# EAGLE schematic plugV15-smd (EAGLE 7.5.0)
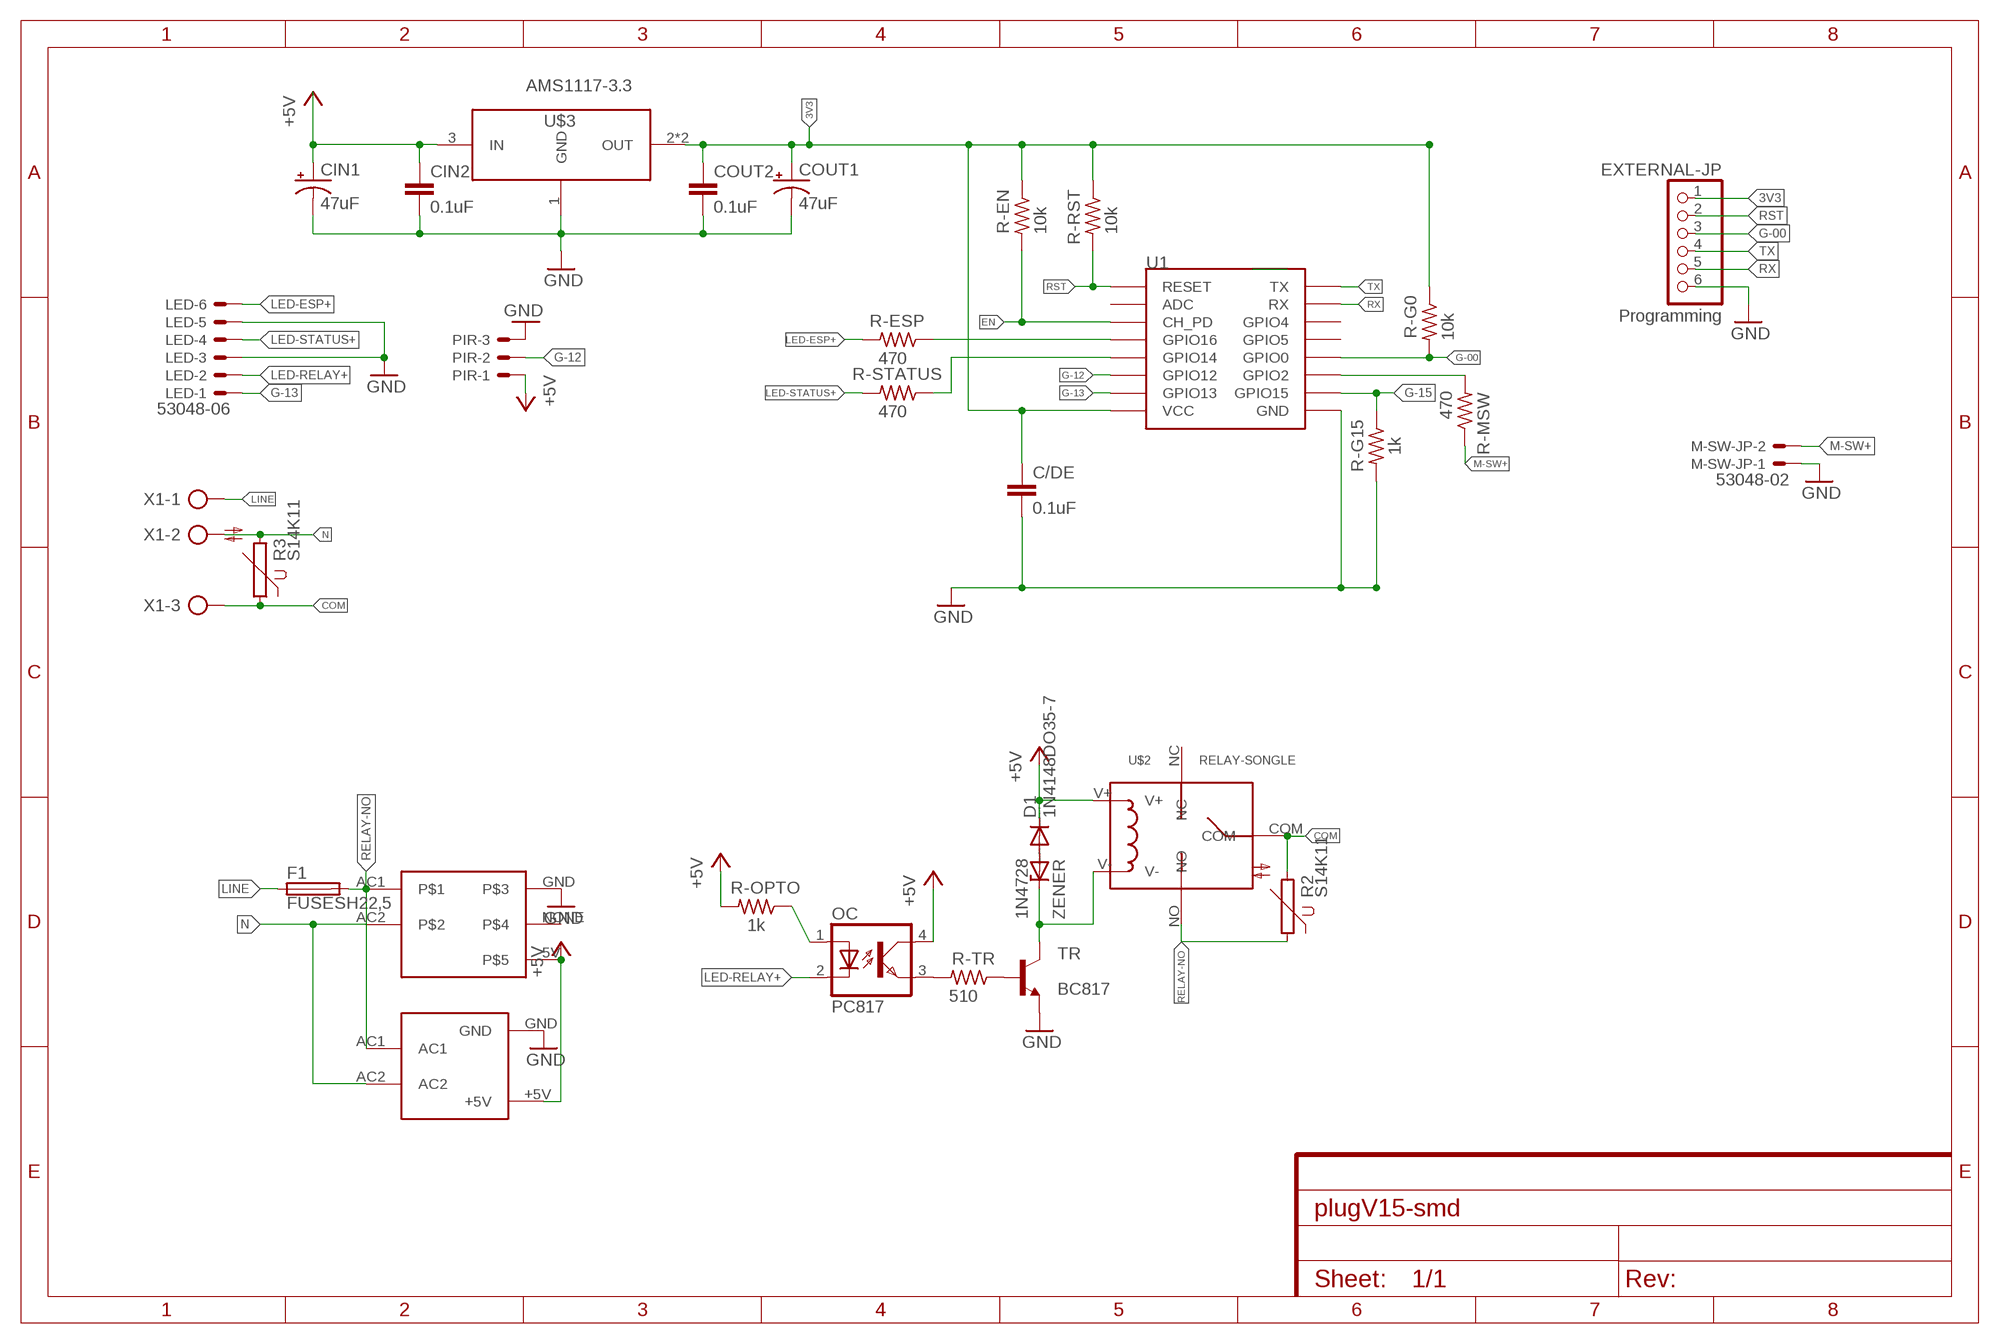
[diagram p0: schematic, sheet 1]

## Parts
C/DE  0.1uF  C-EUC0805  [C0805]
CIN1  47uF  CPOL-USE2.5-5  [E2,5-5]
CIN2  0.1uF  C-EUC0805  [C0805]
COUT1  47uF  CPOL-USE2.5-5  [E2,5-5]
COUT2  0.1uF  C-EUC0805  [C0805]
D1  1N4148DO35-7  [DO35-7]
EXTERNAL-JP  Programming  PINHD-1X6  [1X06]
F1  FUSESH22,5  [SH22,5]
LED  53048-06  [53048-06]
M-SW-JP  53048-02  [53048-02]
OC  PC817  [DIL04]
PIR  53048-03  [53048-03]
R2  S14K11  [S14K11]
R3  S14K11  [S14K11]
R-EN  10k  R-US_M0805  [M0805]
R-ESP  470  R-US_M0805  [M0805]
R-G0  10k  R-US_M0805  [M0805]
R-G15  1k  R-US_M0805  [M0805]
R-MSW  470  R-US_M0805  [M0805]
R-OPTO  1k  R-US_M0805  [M0805]
R-RST  10k  R-US_M0805  [M0805]
R-STATUS  470  R-US_M0805  [M0805]
R-TR  510  R-US_M0805  [M0805]
TR  BC817  BC817-16SMD  [SOT23-BEC]
U1  ESP12SMD  [ESP12-SMD]
U$1  HLK-PM01  [HLK-PM01]
U$2  RELAY-SONGLE  [RELAY-SONGLE]
U$3  AMS1117-3.3  [SOT-223]
U$4  POWERSUPPLY-5V-700MA  [POWERSUPPLY-5V-700MA]
X1  AK300/3  [AK300/3]
ZENER  1N4728  [DO41Z10]

## Nets
3V3: C/DE.1 COUT1.+ COUT2.1 EXTERNAL-JP.1 R-EN.1 R-G0.1 R-RST.1 U1.VCC U$3.2(OUT) U$3.4(OUT)
+5V: CIN1.+ CIN2.1 D1.C OC.4(COL) PIR.1 R-OPTO.2 U$1.+5V U$2.V+ U$3.3(IN) U$4.5V
COM: R2.2 R3.1 U$2.COM X1.3
EN: R-EN.2 U1.CH_PD
G-00: EXTERNAL-JP.3 R-G0.2 U1.GPIO0
G-12: PIR.2 U1.GPIO12
G-13: LED.1 U1.GPIO13
G-15: R-G15.1 U1.GPIO15
GND: C/DE.2 CIN1.- CIN2.2 COUT1.- COUT2.2 EXTERNAL-JP.6 LED.3 LED.5 M-SW-JP.1 PIR.3 R-G15.2 TR.E U1.GND U$1.GND U$3.1(GND) U$4.GND
LED-ESP+: LED.6 R-ESP.2
LED-RELAY+: LED.2 OC.2(C)
LED-STATUS+: LED.4 R-STATUS.2
LINE: F1.1 X1.1
M-SW+: M-SW-JP.2 R-MSW.1
N: R3.2 U$1.AC2 U$4.AC2 X1.2
N$1: OC.3(EMIT) R-TR.2
N$2: R-TR.1 TR.B
N$7: R-MSW.2 U1.GPIO2
N$8: R-STATUS.1 U1.GPIO14
N$13: OC.1(A) R-OPTO.1
N$16: D1.A ZENER.A
N$17: TR.C U$2.V- ZENER.C
N$19: R-ESP.1 U1.GPIO16
RELAY-NO: F1.2 R2.1 U$1.AC1 U$2.NO U$4.AC1
RST: EXTERNAL-JP.2 R-RST.2 U1.RESET
RX: EXTERNAL-JP.5 U1.RXD0(RX)
TX: EXTERNAL-JP.4 U1.TXD0(TX)
Unconnected: U1.ADC U1.GPIO4 U1.GPIO5 U$2.NC U$4.NONE

## Library data of the parts
C/DE CIN2 COUT2 = rcl:C-EU: CAPACITOR, European symbol
CIN1 COUT1 = rcl:CPOL-US: POLARIZED CAPACITOR, American symbol
D1 = diode:1N4148: DIODE high speed (Philips)
EXTERNAL-JP = pinhead:PINHD-1X6: PIN HEADER
F1 = fuse:FUSE: Fuse; OC_FARNELL: unknown; OC_NEWARK: unknown
LED = con-molex:53?-06: CONNECTOR wire to board 1.25 mm (.049 inch) pitch header; MF: WALDOM/MOLEX; MPN: 53048-0610; OC_FARNELL: 1012260; OC_NEWARK: 38C9911
M-SW-JP = con-molex:53?-02: CONNECTOR wire to board 1.25 mm (.049 inch) pitch header; MF: MOLEX; MPN: 53048-0210; OC_FARNELL: 1012259; OC_NEWARK: 57H4718
OC = optocoupler:PC817: SHARP OPTO COUPLER; MPN: PC817X4J000F; OC_FARNELL: 9707727; OC_NEWARK: 97K7059
PIR = con-molex:53?-03: CONNECTOR wire to board 1.25 mm (.049 inch) pitch header; MF: WALDOM/MOLEX; MPN: 53048-0310; OC_FARNELL: 9732918; OC_NEWARK: 38C9908
R2 R3 = varistor:S14K11: VARISTOR
R-EN R-ESP R-G0 R-G15 R-MSW R-OPTO R-RST R-STATUS R-TR = rcl:R-US_: RESISTOR, American symbol
TR = transistor-npn:BC817*: NPN Transistor
U1 = esp8266modules:ESP12: ESP8266 Wifi module 12
U$1 = HLK-PM01:HLK-PM01
U$2 = Seeed-OPL-Relay:RELAY-SONGLE
U$3 = AMS1117-3.3:AMS1117-3.3: 1A LOW DROPOUT VOLTAGE REGULATOR
U$4 = PowerSupply-5V-700mA:POWERSUPPLY-5V-700MA
X1 = con-ptr500:AK300/3: CONNECTOR; OC_FARNELL: unknown; OC_NEWARK: unknown
ZENER = diode:1N4728: Z DIODE 3.3 V, 1W, 5 percent